# Altium schematic sheet storage.SchDoc
size A4
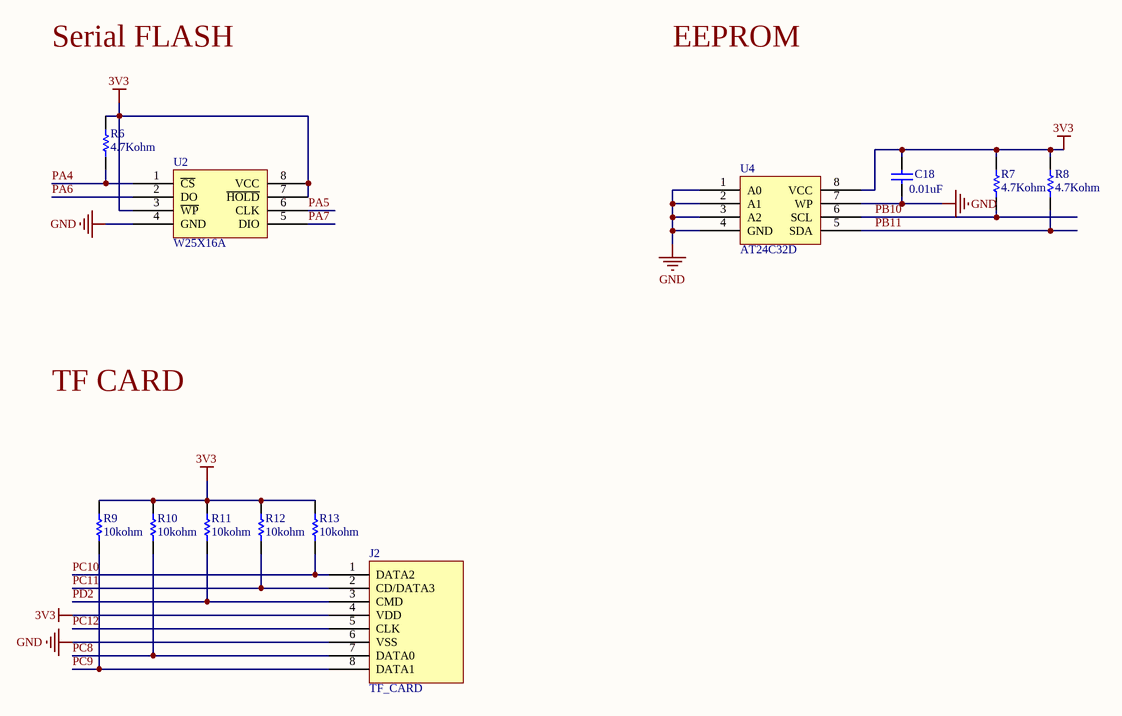
[diagram p0: storage.SchDoc]

## Parts
C18  value 0.01uF  [1608[0603]]  (hidden comment: Cap)
J2  TF_CARD  [MicroSD]
R6  value 4.7Kohm  [J1-0603]  (hidden comment: Res1)
R7  value 4.7Kohm  [J1-0603]  (hidden comment: Res1)
R8  value 4.7Kohm  [J1-0603]  (hidden comment: Res1)
R9  value 10kohm  [J1-0603]  (hidden comment: Res1)
R10  value 10kohm  [J1-0603]  (hidden comment: Res1)
R11  value 10kohm  [J1-0603]  (hidden comment: Res1)
R12  value 10kohm  [J1-0603]  (hidden comment: Res1)
R13  value 10kohm  [J1-0603]  (hidden comment: Res1)
U2  W25X16A  [W25X16A-SOIC127P780X216-8N]
U4  AT24C32D  [AT24C32D-SOIC127P600X175-8N]

## Nets
3V3: C18.2 J2.4(VDD) R6.2 R7.2 R8.2 R9.2 R10.2 R11.2 R12.2 R13.2 U2.3(~{WP}) U2.7(~{HOLD}) U2.8(VCC) U4.8(VCC)
GND: C18.1 J2.6(VSS) U2.4(GND) U4.1(A0) U4.2(A1) U4.3(A2) U4.4(GND) U4.7(WP)
PA4: R6.1 U2.1(~{CS})
PA5: U2.6(CLK)
PA6: U2.2(DO)
PA7: U2.5(DIO)
PB10: R7.1 U4.6(SCL)
PB11: R8.1 U4.5(SDA)
PC8: J2.7(DATA0) R10.1
PC9: J2.8(DATA1) R9.1
PC10: J2.1(DATA2) R13.1
PC11: J2.2(CD/DATA3) R12.1
PC12: J2.5(CLK)
PD2: J2.3(CMD) R11.1

## Notes on the sheet
- Serial FLASH
- EEPROM
- TF CARD
- Title
- Size:
- Date:
- A4
- Number:
- Time:
- Revision:
- Sheet
- of
- File:

## Library data of the parts
C18 = Cap: Capacitor; Published: 8-Jun-2000; LatestRevisionDate: 17-Jul-2002; LatestRevisionNote: Re-released for DXP Platform.; PackageReference: RAD-0.3; Publisher: Altium Limited; PackageDescription: Radial Cap, Thru-Hole; 2 Leads; 0.3 in Pin Spacing
R6-R13 = Res1: Resistor; Published: 8-Jun-2000; LatestRevisionDate: 17-Jul-2002; LatestRevisionNote: Re-released for DXP Platform.; PackageReference: AXIAL-0.3; Publisher: Altium Limited; PackageDescription: Axial Device, Thru-Hole; 2 Leads; 0.3 in Pin Spacing
U2 = W25X16A: W25X16A, Serial Flash, 16M-bit, 2M-Byte
U4 = AT24C32D: EEPROM, 32K